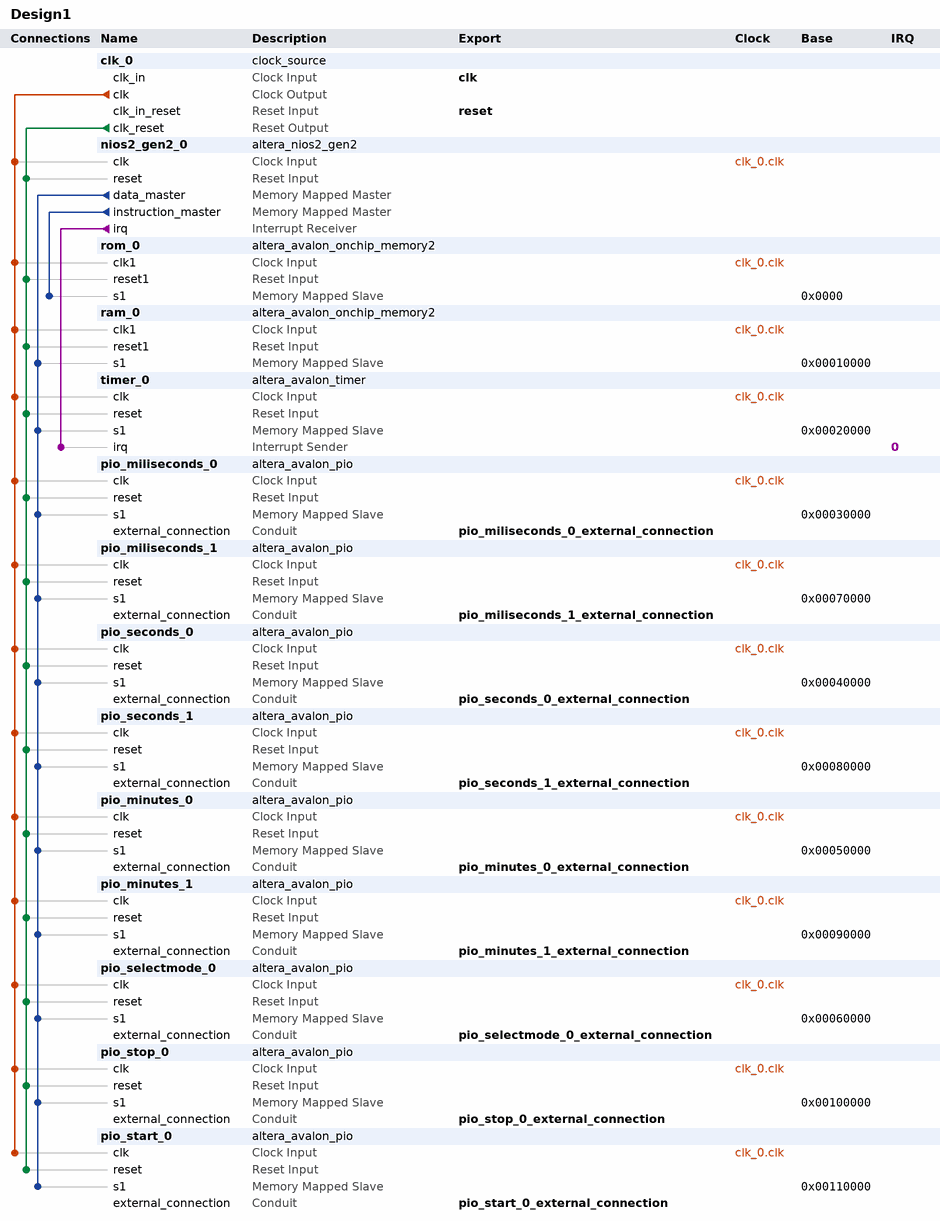
[diagram p0: system contents]
# Platform Designer (Qsys) system Design1, Cyclone V 5CSEMA5F31C6
# Parameters at their usual value, and those the tool derives, are not listed.
package require -exact qsys 22.1
create_system Design1
set_project_property DEVICE_FAMILY {Cyclone V}
set_project_property DEVICE 5CSEMA5F31C6

add_instance clk_0 clock_source 22.1
set_instance_parameter_value clk_0 clockFrequency 50000000

add_instance nios2_gen2_0 altera_nios2_gen2 22.1
set_instance_parameter_value nios2_gen2_0 dcache_size 2048
set_instance_parameter_value nios2_gen2_0 debug_enabled false
set_instance_parameter_value nios2_gen2_0 exceptionSlave rom_0.s1
set_instance_parameter_value nios2_gen2_0 icache_size 4096
set_instance_parameter_value nios2_gen2_0 impl Tiny
set_instance_parameter_value nios2_gen2_0 resetSlave rom_0.s1

add_instance rom_0 altera_avalon_onchip_memory2 22.1
set_instance_parameter_value rom_0 dataWidth 32
set_instance_parameter_value rom_0 dualPort false
set_instance_parameter_value rom_0 initMemContent true
set_instance_parameter_value rom_0 initializationFileName onchip_mem.hex
set_instance_parameter_value rom_0 memorySize 8192
set_instance_parameter_value rom_0 writable false

add_instance ram_0 altera_avalon_onchip_memory2 22.1
set_instance_parameter_value ram_0 dataWidth 32
set_instance_parameter_value ram_0 dualPort false
set_instance_parameter_value ram_0 initMemContent true
set_instance_parameter_value ram_0 initializationFileName onchip_mem.hex
set_instance_parameter_value ram_0 memorySize 16384

add_instance timer_0 altera_avalon_timer 22.1
set_instance_parameter_value timer_0 alwaysRun true
set_instance_parameter_value timer_0 fixedPeriod true
set_instance_parameter_value timer_0 period 1
set_instance_parameter_value timer_0 periodUnits MSEC
set_instance_parameter_value timer_0 snapshot false

add_instance pio_miliseconds_0 altera_avalon_pio 22.1
set_instance_parameter_value pio_miliseconds_0 direction Output
set_instance_parameter_value pio_miliseconds_0 width 7

add_instance pio_miliseconds_1 altera_avalon_pio 22.1
set_instance_parameter_value pio_miliseconds_1 direction Output
set_instance_parameter_value pio_miliseconds_1 width 7

add_instance pio_seconds_0 altera_avalon_pio 22.1
set_instance_parameter_value pio_seconds_0 direction Output
set_instance_parameter_value pio_seconds_0 width 7

add_instance pio_seconds_1 altera_avalon_pio 22.1
set_instance_parameter_value pio_seconds_1 direction Output
set_instance_parameter_value pio_seconds_1 width 7

add_instance pio_minutes_0 altera_avalon_pio 22.1
set_instance_parameter_value pio_minutes_0 direction Output
set_instance_parameter_value pio_minutes_0 width 7

add_instance pio_minutes_1 altera_avalon_pio 22.1
set_instance_parameter_value pio_minutes_1 direction Output
set_instance_parameter_value pio_minutes_1 width 7

add_instance pio_selectmode_0 altera_avalon_pio 22.1
set_instance_parameter_value pio_selectmode_0 direction Input
set_instance_parameter_value pio_selectmode_0 width 2

add_instance pio_stop_0 altera_avalon_pio 22.1
set_instance_parameter_value pio_stop_0 direction Input
set_instance_parameter_value pio_stop_0 width 1

add_instance pio_start_0 altera_avalon_pio 22.1
set_instance_parameter_value pio_start_0 direction Input
set_instance_parameter_value pio_start_0 width 1

# connections
add_connection clk_0.clk nios2_gen2_0.clk clock
add_connection clk_0.clk pio_miliseconds_0.clk clock
add_connection clk_0.clk pio_miliseconds_1.clk clock
add_connection clk_0.clk pio_minutes_0.clk clock
add_connection clk_0.clk pio_minutes_1.clk clock
add_connection clk_0.clk pio_seconds_0.clk clock
add_connection clk_0.clk pio_seconds_1.clk clock
add_connection clk_0.clk pio_selectmode_0.clk clock
add_connection clk_0.clk pio_start_0.clk clock
add_connection clk_0.clk pio_stop_0.clk clock
add_connection clk_0.clk ram_0.clk1 clock
add_connection clk_0.clk rom_0.clk1 clock
add_connection clk_0.clk timer_0.clk clock
add_connection clk_0.clk_reset nios2_gen2_0.reset reset
add_connection clk_0.clk_reset pio_miliseconds_0.reset reset
add_connection clk_0.clk_reset pio_miliseconds_1.reset reset
add_connection clk_0.clk_reset pio_minutes_0.reset reset
add_connection clk_0.clk_reset pio_minutes_1.reset reset
add_connection clk_0.clk_reset pio_seconds_0.reset reset
add_connection clk_0.clk_reset pio_seconds_1.reset reset
add_connection clk_0.clk_reset pio_selectmode_0.reset reset
add_connection clk_0.clk_reset pio_start_0.reset reset
add_connection clk_0.clk_reset pio_stop_0.reset reset
add_connection clk_0.clk_reset ram_0.reset1 reset
add_connection clk_0.clk_reset rom_0.reset1 reset
add_connection clk_0.clk_reset timer_0.reset reset
add_connection nios2_gen2_0.data_master pio_miliseconds_0.s1 avalon
set_connection_parameter_value nios2_gen2_0.data_master/pio_miliseconds_0.s1 baseAddress 0x00030000
add_connection nios2_gen2_0.data_master pio_miliseconds_1.s1 avalon
set_connection_parameter_value nios2_gen2_0.data_master/pio_miliseconds_1.s1 baseAddress 0x00070000
add_connection nios2_gen2_0.data_master pio_minutes_0.s1 avalon
set_connection_parameter_value nios2_gen2_0.data_master/pio_minutes_0.s1 baseAddress 0x00050000
add_connection nios2_gen2_0.data_master pio_minutes_1.s1 avalon
set_connection_parameter_value nios2_gen2_0.data_master/pio_minutes_1.s1 baseAddress 0x00090000
add_connection nios2_gen2_0.data_master pio_seconds_0.s1 avalon
set_connection_parameter_value nios2_gen2_0.data_master/pio_seconds_0.s1 baseAddress 0x00040000
add_connection nios2_gen2_0.data_master pio_seconds_1.s1 avalon
set_connection_parameter_value nios2_gen2_0.data_master/pio_seconds_1.s1 baseAddress 0x00080000
add_connection nios2_gen2_0.data_master pio_selectmode_0.s1 avalon
set_connection_parameter_value nios2_gen2_0.data_master/pio_selectmode_0.s1 baseAddress 0x00060000
add_connection nios2_gen2_0.data_master pio_start_0.s1 avalon
set_connection_parameter_value nios2_gen2_0.data_master/pio_start_0.s1 baseAddress 0x00110000
add_connection nios2_gen2_0.data_master pio_stop_0.s1 avalon
set_connection_parameter_value nios2_gen2_0.data_master/pio_stop_0.s1 baseAddress 0x00100000
add_connection nios2_gen2_0.data_master ram_0.s1 avalon
set_connection_parameter_value nios2_gen2_0.data_master/ram_0.s1 baseAddress 0x00010000
add_connection nios2_gen2_0.data_master timer_0.s1 avalon
set_connection_parameter_value nios2_gen2_0.data_master/timer_0.s1 baseAddress 0x00020000
add_connection nios2_gen2_0.instruction_master rom_0.s1 avalon
set_connection_parameter_value nios2_gen2_0.instruction_master/rom_0.s1 baseAddress 0x0000
add_connection nios2_gen2_0.irq timer_0.irq interrupt
set_connection_parameter_value nios2_gen2_0.irq/timer_0.irq irqNumber 0

# exported interfaces
add_interface clk clock sink
set_interface_property clk EXPORT_OF clk_0.clk_in
add_interface pio_miliseconds_0_external_connection conduit end
set_interface_property pio_miliseconds_0_external_connection EXPORT_OF pio_miliseconds_0.external_connection
add_interface pio_miliseconds_1_external_connection conduit end
set_interface_property pio_miliseconds_1_external_connection EXPORT_OF pio_miliseconds_1.external_connection
add_interface pio_minutes_0_external_connection conduit end
set_interface_property pio_minutes_0_external_connection EXPORT_OF pio_minutes_0.external_connection
add_interface pio_minutes_1_external_connection conduit end
set_interface_property pio_minutes_1_external_connection EXPORT_OF pio_minutes_1.external_connection
add_interface pio_seconds_0_external_connection conduit end
set_interface_property pio_seconds_0_external_connection EXPORT_OF pio_seconds_0.external_connection
add_interface pio_seconds_1_external_connection conduit end
set_interface_property pio_seconds_1_external_connection EXPORT_OF pio_seconds_1.external_connection
add_interface pio_selectmode_0_external_connection conduit end
set_interface_property pio_selectmode_0_external_connection EXPORT_OF pio_selectmode_0.external_connection
add_interface pio_start_0_external_connection conduit end
set_interface_property pio_start_0_external_connection EXPORT_OF pio_start_0.external_connection
add_interface pio_stop_0_external_connection conduit end
set_interface_property pio_stop_0_external_connection EXPORT_OF pio_stop_0.external_connection
add_interface reset reset sink
set_interface_property reset EXPORT_OF clk_0.clk_in_reset

set_interconnect_requirement {$system} qsys_mm.clockCrossingAdapter HANDSHAKE
set_interconnect_requirement {$system} qsys_mm.enableEccProtection FALSE
set_interconnect_requirement {$system} qsys_mm.insertDefaultSlave FALSE
set_interconnect_requirement {$system} qsys_mm.maxAdditionalLatency 1

save_system Design1.qsys
